# Altium project LimeSDR-Mini_2v1.PrjPcb (part 5 of 5)
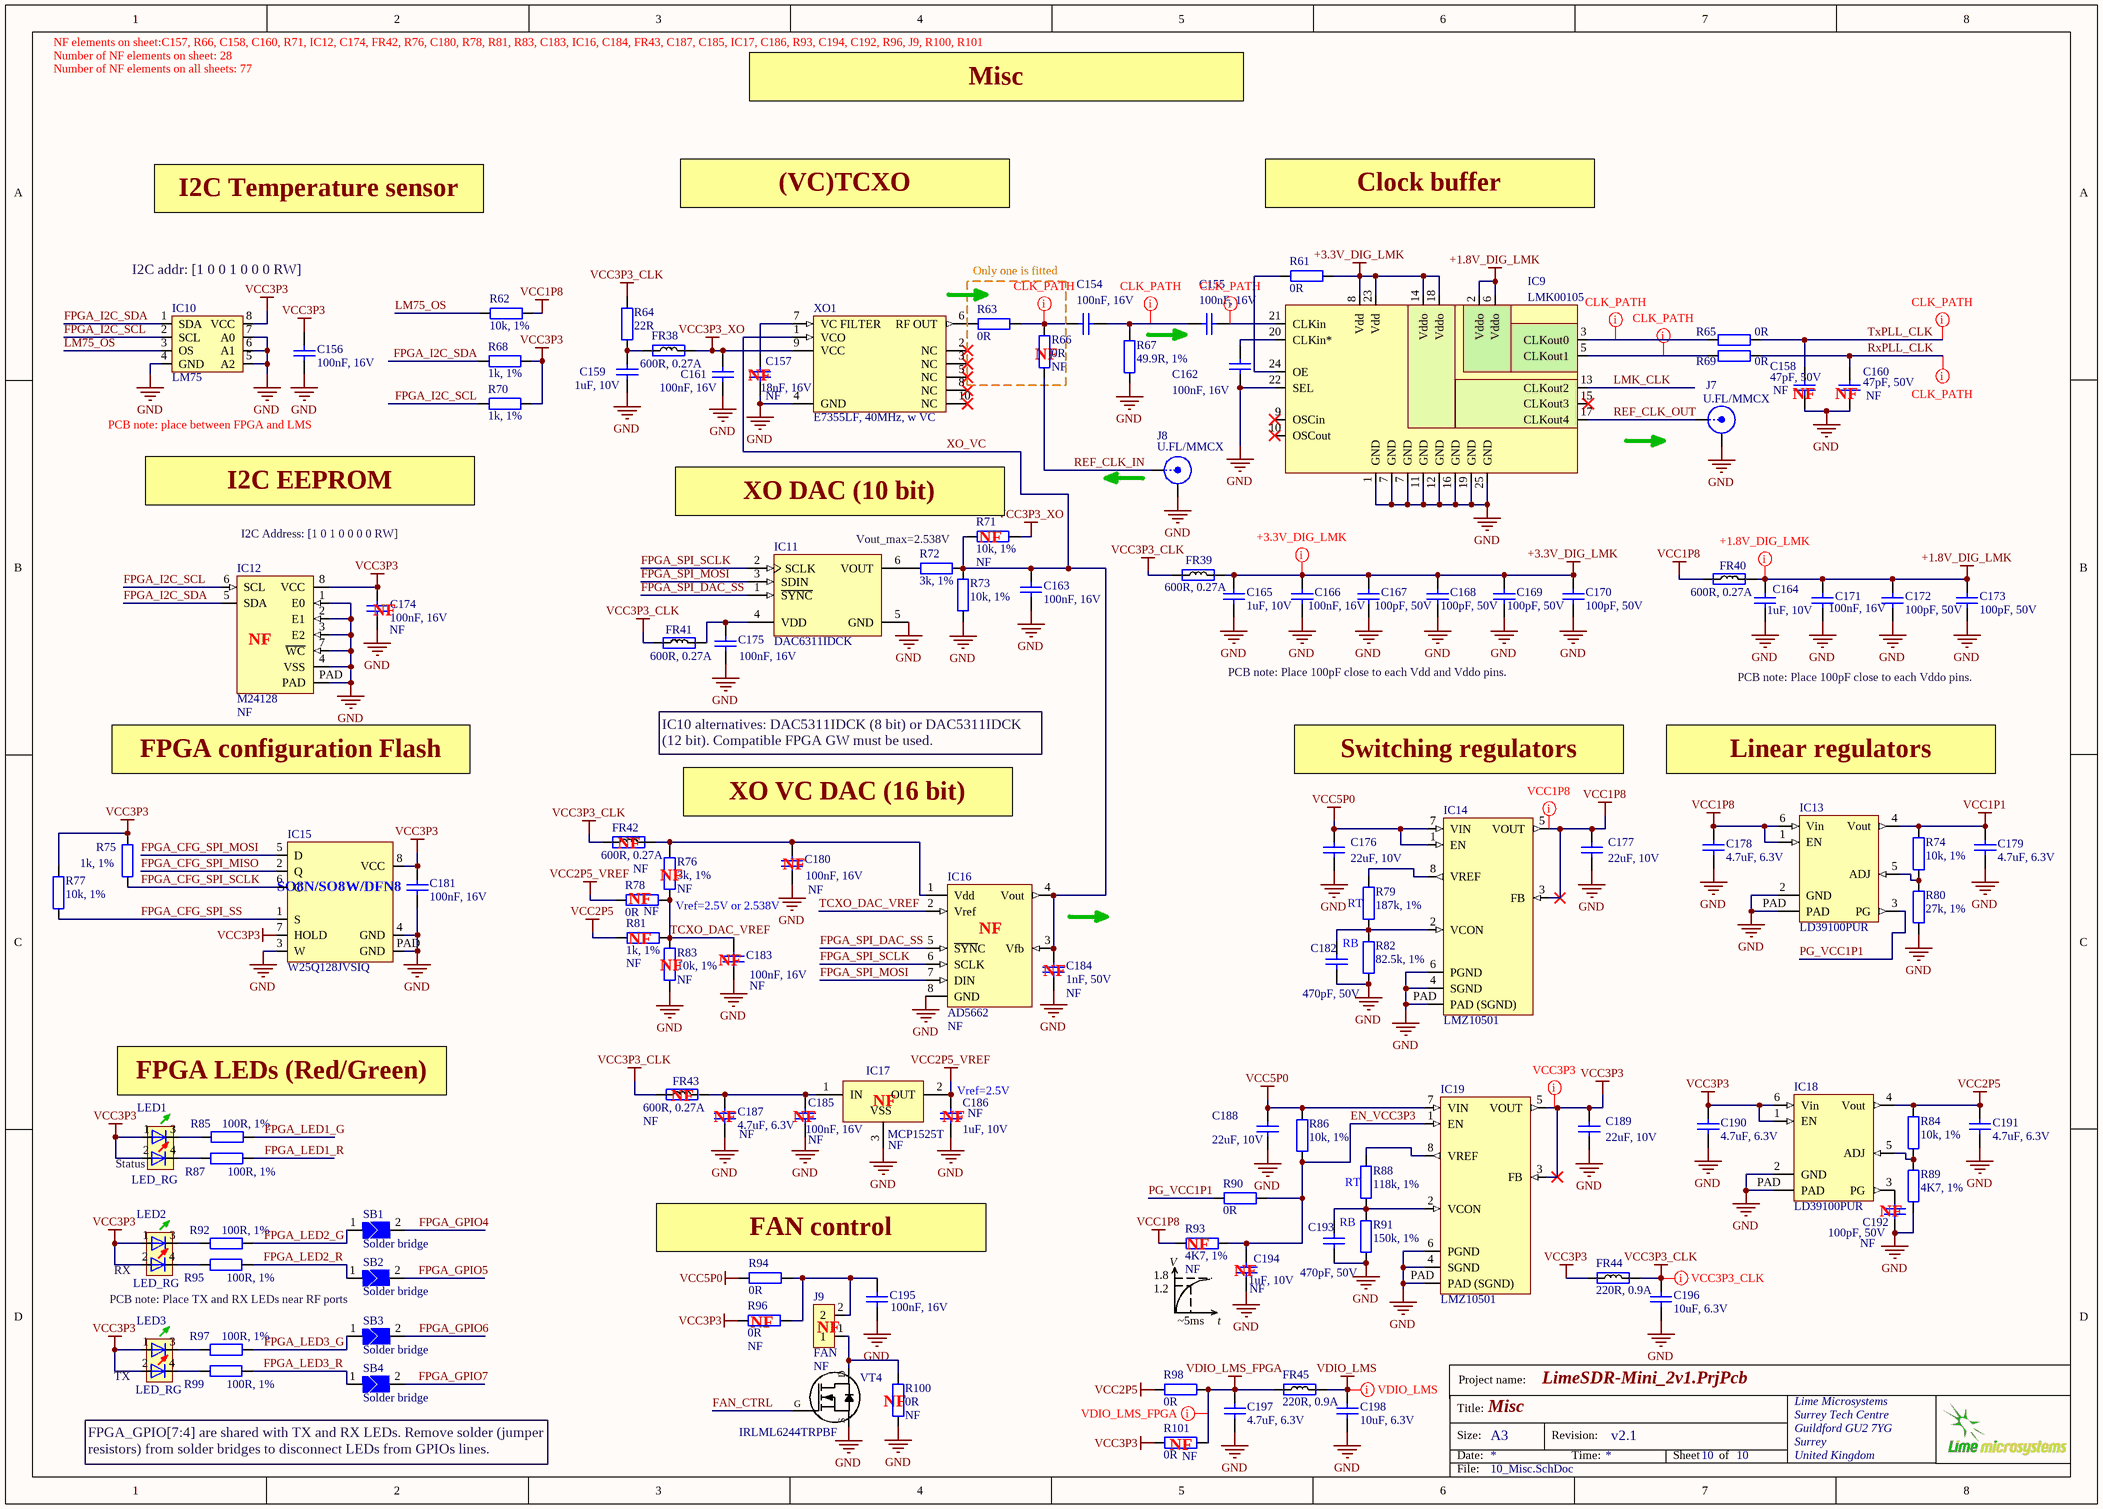
[diagram p109: 10_Misc.SchDoc]

## Nets that join several sheets
GND: 05_LMS7002M_Misc (23 pins), 06_LMS7002M_RF (43 pins), 07_LMS7002M_Power (98 pins), 08_FPGA (165 pins), 09_USB3_0_FIFO (38 pins), 10_Misc (89 pins)
VCC1P1: 08_FPGA (24 pins), 10_Misc (C179.2 IC13.4 R74.2)
VCC1P8: 07_LMS7002M_Power (FR23.1), 10_Misc (9 pins)
VCC1P8_LMS: 06_LMS7002M_RF (13 pins), 07_LMS7002M_Power (15 pins)
VCC2P5: 08_FPGA (9 pins), 10_Misc (5 pins)
VCC3P3: 06_LMS7002M_RF (R14.1 R20.1), 08_FPGA (25 pins), 09_USB3_0_FIFO (20 pins), 10_Misc (26 pins)
VCC5P0: 06_LMS7002M_RF (R15.1 R21.1), 08_FPGA (J4.5 J5.7 R43.1), 09_USB3_0_FIFO (FR36.2), 10_Misc (7 pins)
VDIO_LMS: 05_LMS7002M_Misc (9 pins), 07_LMS7002M_Power (5 pins), 10_Misc (C198.2 FR45.2)
VDIO_LMS_FPGA: 08_FPGA (9 pins), 10_Misc (C197.2 FR45.1 R98.2 R101.2)
FAN_CTRL: 08_FPGA (IC7.A11), 10_Misc (VT4.G)
FPGA_CFG_SPI_MISO: 08_FPGA (IC7.T18), 10_Misc (IC15.2)
FPGA_CFG_SPI_MOSI: 08_FPGA (IC7.U18), 10_Misc (IC15.5)
FPGA_CFG_SPI_SCLK: 08_FPGA (IC7.U16), 10_Misc (IC15.6 R75.1)
FPGA_CFG_SPI_SS: 08_FPGA (IC7.U17), 10_Misc (IC15.1 R77.1)
FPGA_GPIO4: 08_FPGA (IC7.M18 J3.5), 10_Misc (SB1.2)
FPGA_GPIO5: 08_FPGA (IC7.R18 J3.6), 10_Misc (SB2.2)
FPGA_GPIO6: 08_FPGA (IC7.T17 J3.7), 10_Misc (SB3.2)
FPGA_GPIO7: 08_FPGA (IC7.R17 J3.8), 10_Misc (SB4.2)
FPGA_I2C_SCL: 08_FPGA (IC7.C10), 10_Misc (IC10.2 IC12.6 R70.2)
FPGA_I2C_SDA: 08_FPGA (IC7.B9), 10_Misc (IC10.1 IC12.5 R68.2)
FPGA_LED1_G: 08_FPGA (IC7.R16), 10_Misc (R85.2)
FPGA_LED1_R: 08_FPGA (IC7.V17), 10_Misc (R87.2)
FPGA_SPI_DAC_SS: 08_FPGA (IC7.L4), 10_Misc (IC11.1 IC16.5)
FPGA_SPI_LMS_SS: 05_LMS7002M_Misc (R11.2), 08_FPGA (IC7.N3)
FPGA_SPI_MISO: 05_LMS7002M_Misc (R10.2), 08_FPGA (IC7.K3)
FPGA_SPI_MOSI: 05_LMS7002M_Misc (R9.2), 08_FPGA (IC7.L3), 10_Misc (IC11.3 IC16.7)
FPGA_SPI_SCLK: 05_LMS7002M_Misc (R8.2), 08_FPGA (IC7.M3), 10_Misc (IC11.2 IC16.6)
FT_BE0: 08_FPGA (IC7.L15), 09_USB3_0_FIFO (IC8.4)
FT_BE1: 08_FPGA (IC7.J17), 09_USB3_0_FIFO (IC8.5)
FT_BE2: 08_FPGA (IC7.K16), 09_USB3_0_FIFO (IC8.6)
FT_BE3: 08_FPGA (IC7.H17), 09_USB3_0_FIFO (IC8.7)
FT_CLK: 08_FPGA (IC7.D17), 09_USB3_0_FIFO (R59.1)
FT_D0: 08_FPGA (IC7.A13), 09_USB3_0_FIFO (IC8.40)
FT_D1: 08_FPGA (IC7.B12), 09_USB3_0_FIFO (IC8.41)
FT_D2: 08_FPGA (IC7.B15), 09_USB3_0_FIFO (IC8.42)
FT_D3: 08_FPGA (IC7.C12), 09_USB3_0_FIFO (IC8.43)
FT_D4: 08_FPGA (IC7.A16), 09_USB3_0_FIFO (IC8.44)
FT_D5: 08_FPGA (IC7.A12), 09_USB3_0_FIFO (IC8.45)
FT_D6: 08_FPGA (IC7.D18), 09_USB3_0_FIFO (IC8.46)
FT_D7: 08_FPGA (IC7.B17), 09_USB3_0_FIFO (IC8.47)
FT_D8: 08_FPGA (IC7.F15), 09_USB3_0_FIFO (IC8.50)
FT_D9: 08_FPGA (IC7.D16), 09_USB3_0_FIFO (IC8.51)
FT_D10: 08_FPGA (IC7.D15), 09_USB3_0_FIFO (IC8.52)
FT_D11: 08_FPGA (IC7.C13), 09_USB3_0_FIFO (IC8.53)
FT_D12: 08_FPGA (IC7.H18), 09_USB3_0_FIFO (IC8.54)
FT_D13: 08_FPGA (IC7.B13), 09_USB3_0_FIFO (IC8.55)
FT_D14: 08_FPGA (IC7.J18), 09_USB3_0_FIFO (IC8.56)
FT_D15: 08_FPGA (IC7.A15), 09_USB3_0_FIFO (IC8.57)
FT_D16: 08_FPGA (IC7.B18), 09_USB3_0_FIFO (IC8.60)
FT_D17: 08_FPGA (IC7.C18), 09_USB3_0_FIFO (IC8.61)
FT_D18: 08_FPGA (IC7.A17), 09_USB3_0_FIFO (IC8.62)
FT_D19: 08_FPGA (IC7.K18), 09_USB3_0_FIFO (IC8.63)
FT_D20: 08_FPGA (IC7.C15), 09_USB3_0_FIFO (IC8.64)
FT_D21: 08_FPGA (IC7.L18), 09_USB3_0_FIFO (IC8.65)
FT_D22: 08_FPGA (IC7.F18), 09_USB3_0_FIFO (IC8.66)
FT_D23: 08_FPGA (IC7.C16), 09_USB3_0_FIFO (IC8.67)
FT_D24: 08_FPGA (IC7.G16), 09_USB3_0_FIFO (IC8.69)
FT_D25: 08_FPGA (IC7.D13), 09_USB3_0_FIFO (IC8.70)
FT_D26: 08_FPGA (IC7.G18), 09_USB3_0_FIFO (IC8.71)
FT_D27: 08_FPGA (IC7.F16), 09_USB3_0_FIFO (IC8.72)
FT_D28: 08_FPGA (IC7.C17), 09_USB3_0_FIFO (IC8.73)
FT_D29: 08_FPGA (IC7.F17), 09_USB3_0_FIFO (IC8.74)
FT_D30: 08_FPGA (IC7.K15), 09_USB3_0_FIFO (IC8.75)
FT_D31: 08_FPGA (IC7.K17), 09_USB3_0_FIFO (IC8.76)
FT_OEn: 08_FPGA (IC7.L16), 09_USB3_0_FIFO (IC8.13)
FT_RDn: 08_FPGA (IC7.H15), 09_USB3_0_FIFO (IC8.12)
FT_RESETn: 08_FPGA (IC7.M17), 09_USB3_0_FIFO (C132.1 IC8.15 R56.1)
FT_RXFn: 08_FPGA (IC7.H16), 09_USB3_0_FIFO (IC8.9)
FT_TXEn: 08_FPGA (IC7.M16), 09_USB3_0_FIFO (IC8.8)
FT_WAKEUPn: 08_FPGA (IC7.G15), 09_USB3_0_FIFO (IC8.16 R55.1)
FT_WRn: 08_FPGA (IC7.J16), 09_USB3_0_FIFO (IC8.11)
LM75_OS: 08_FPGA (IC7.K2), 10_Misc (IC10.3 R62.1)
LMK_CLK: 08_FPGA (IC7.A9), 10_Misc (IC9.13)
LMS_CORE_LDO_EN: 05_LMS7002M_Misc (IC1.U33 R7.1), 08_FPGA (IC7.C6)
LMS_DIQ1_D0: 05_LMS7002M_Misc (IC1.AG31), 08_FPGA (IC7.J2)
LMS_DIQ1_D1: 05_LMS7002M_Misc (IC1.AF30), 08_FPGA (IC7.L1)
LMS_DIQ1_D2: 05_LMS7002M_Misc (IC1.AF34), 08_FPGA (IC7.K1)
LMS_DIQ1_D3: 05_LMS7002M_Misc (IC1.AE31), 08_FPGA (IC7.K4)
LMS_DIQ1_D4: 05_LMS7002M_Misc (IC1.AD30), 08_FPGA (IC7.G3)
LMS_DIQ1_D5: 05_LMS7002M_Misc (IC1.AC29), 08_FPGA (IC7.F4)
LMS_DIQ1_D6: 05_LMS7002M_Misc (IC1.AE33), 08_FPGA (IC7.J1)
LMS_DIQ1_D7: 05_LMS7002M_Misc (IC1.AD32), 08_FPGA (IC7.H1)
LMS_DIQ1_D8: 05_LMS7002M_Misc (IC1.AC31), 08_FPGA (IC7.G4)
LMS_DIQ1_D9: 05_LMS7002M_Misc (IC1.AC33), 08_FPGA (IC7.F2)
LMS_DIQ1_D10: 05_LMS7002M_Misc (IC1.AB30), 08_FPGA (IC7.G1)
LMS_DIQ1_D11: 05_LMS7002M_Misc (IC1.AB32), 08_FPGA (IC7.H2)
LMS_DIQ2_D0: 05_LMS7002M_Misc (IC1.H30), 08_FPGA (IC7.A3)
LMS_DIQ2_D1: 05_LMS7002M_Misc (IC1.J31), 08_FPGA (IC7.C2)
LMS_DIQ2_D2: 05_LMS7002M_Misc (IC1.K30), 08_FPGA (IC7.A2)
LMS_DIQ2_D3: 05_LMS7002M_Misc (IC1.K32), 08_FPGA (IC7.B4)
LMS_DIQ2_D4: 05_LMS7002M_Misc (IC1.L31), 08_FPGA (IC7.C3)
LMS_DIQ2_D5: 05_LMS7002M_Misc (IC1.K34), 08_FPGA (IC7.B2)
LMS_DIQ2_D6: 05_LMS7002M_Misc (IC1.M30), 08_FPGA (IC7.D3)
LMS_DIQ2_D7: 05_LMS7002M_Misc (IC1.M32), 08_FPGA (IC7.B1)
LMS_DIQ2_D8: 05_LMS7002M_Misc (IC1.N31), 08_FPGA (IC7.A4)
LMS_DIQ2_D9: 05_LMS7002M_Misc (IC1.N33), 08_FPGA (IC7.C1)
LMS_DIQ2_D10: 05_LMS7002M_Misc (IC1.P30), 08_FPGA (IC7.C7)
LMS_DIQ2_D11: 05_LMS7002M_Misc (IC1.P32), 08_FPGA (IC7.A6)
LMS_EN_IQSEL1: 05_LMS7002M_Misc (IC1.Y32), 08_FPGA (IC7.F3)
LMS_EN_IQSEL2: 05_LMS7002M_Misc (IC1.R33), 08_FPGA (IC7.C4)
LMS_FCLK1: 05_LMS7002M_Misc (IC1.AA33), 08_FPGA (IC7.H3)
LMS_FCLK2: 05_LMS7002M_Misc (IC1.R29), 08_FPGA (IC7.D1)
LMS_MCLK1: 05_LMS7002M_Misc (IC1.AB34), 08_FPGA (IC7.H4)
LMS_MCLK2: 05_LMS7002M_Misc (IC1.P34), 08_FPGA (IC7.D2)
LMS_RESET: 05_LMS7002M_Misc (IC1.E27 R4.1), 08_FPGA (IC7.A7)
LMS_RXEN: 05_LMS7002M_Misc (IC1.V34 R6.2), 08_FPGA (IC7.D6)
LMS_TXEN: 05_LMS7002M_Misc (IC1.U29 R5.2), 08_FPGA (IC7.B7)
LMS_TXNRX1: 05_LMS7002M_Misc (IC1.V32 R3.1), 08_FPGA (IC7.F1)
LMS_TXNRX2: 05_LMS7002M_Misc (IC1.U31 R12.1), 08_FPGA (IC7.B6)
RFSW_RX_V1: 06_LMS7002M_RF (C29.2 IC4.5), 08_FPGA (IC7.C11)
RFSW_RX_V2: 06_LMS7002M_RF (C28.2 IC4.2), 08_FPGA (IC7.B11)
RFSW_TX_V1: 06_LMS7002M_RF (C14.2 IC3.5), 08_FPGA (IC7.B10)
RFSW_TX_V2: 06_LMS7002M_RF (C13.2 IC3.2), 08_FPGA (IC7.C9)
RxPLL_CLK: 05_LMS7002M_Misc (IC1.AM24), 10_Misc (C160.2 R69.1)
TX_LB_AT: 06_LMS7002M_RF (C19.1 R17.2), 08_FPGA (IC7.C8)
TX_LB_SH: 06_LMS7002M_RF (C20.1 C23.1 R24.1 R25.2), 08_FPGA (IC7.B8)
TxPLL_CLK: 05_LMS7002M_Misc (IC1.E5), 10_Misc (C158.2 R65.1)